# Altium schematic sheet MDL_RECEPTOR_IRF.SchDoc
size A4
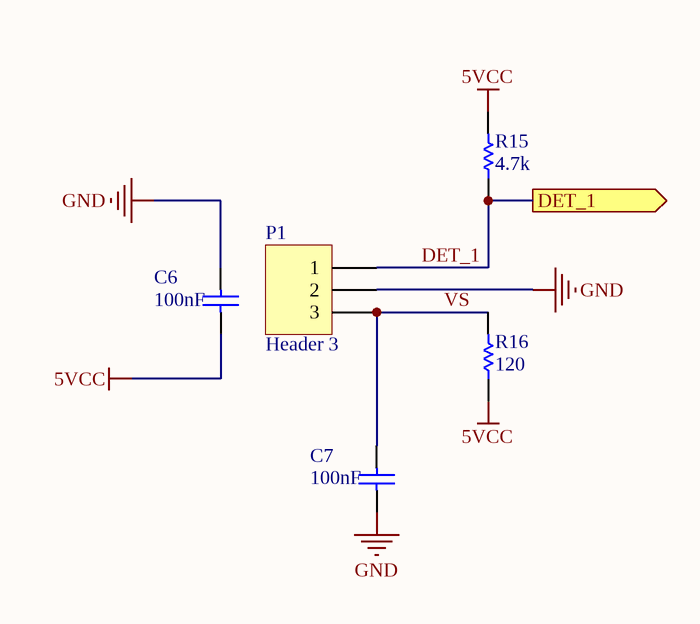
[diagram p0: MDL_RECEPTOR_IRF.SchDoc]

## Parts
C6  value 100nF  [VP44-2.5]  (hidden comment: VP44BY224JB)
C7  value 100nF  [VP44-2.5]  (hidden comment: VP44BY224JB)
P1  Header 3  [HDR1X3]
R15  value 4.7k  [AXIAL-0.3]  (hidden comment: Res)
R16  value 120  [AXIAL-0.3]  (hidden comment: Res)

## Ports
DET_1 (out)

## Nets
5VCC: C6.2 R15.2 R16.1
GND: C6.1 C7.2 P1.2
DET_1: P1.1 R15.1 ; port DET_1
VS: C7.1 P1.3 R16.2

## Library data of the parts
C6 C7 = VP44BY224JB: Dipped Radial Multilayer Ceramic Capacitor X7R: 220nF, 100V; Published: 17-Dec-2003; DatasheetDocument: 4-Feb-2002; PackageDocument: 4-Feb-2002; PackageReference: VP44-2.5; Publisher: Altium Limited; ComponentLink1Description: Manufacturer Link; ComponentLink1URL: http://www.vishay.com/
P1 = Header 3: Header, 3-Pin; LatestRevisionDate: 17-Jul-2002; LatestRevisionNote: Re-released for DXP Platform.; Publisher: Altium Limited
R15 R16 = Res1: Resistor; Published: 8-Jun-2000; LatestRevisionDate: 17-Jul-2002; LatestRevisionNote: Re-released for DXP Platform.; PackageReference: AXIAL-0.3; Publisher: Altium Limited